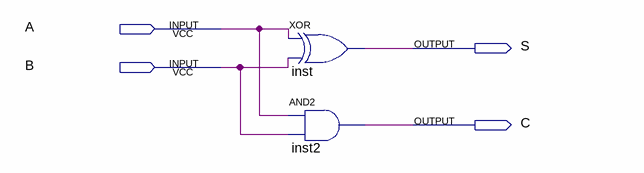
[diagram p0: schematic sheet]
// Quartus schematic half_adder.bdf as structural Verilog: 2 symbols, 4 pins
module half_adder (
  input  A,
  input  B,
  output S,
  output C
);

  xor inst (S, A, B);
  and inst2 (C, A, B);
endmodule
